# EAGLE design MPPC2 (EAGLE 8.2.2)
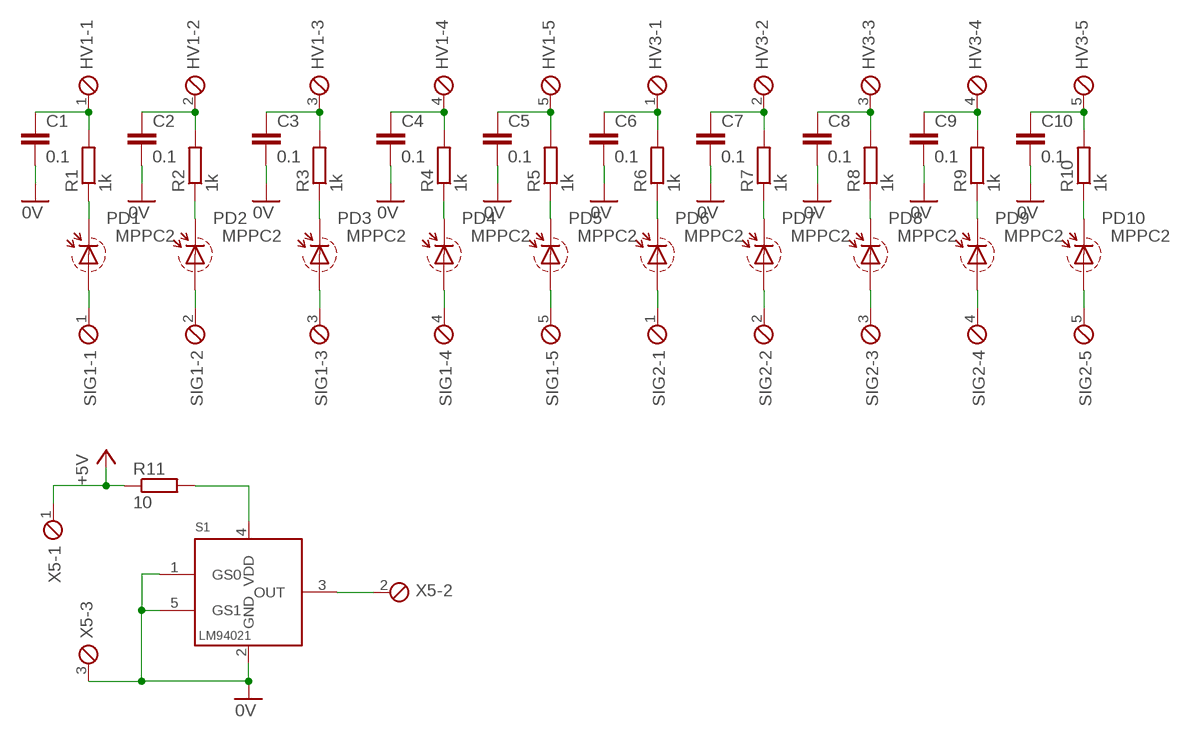
[diagram p0: schematic, sheet 1]

## Parts
C1  0.1  C-EUC0805K  [C0805K]
C2  0.1  C-EUC0805K  [C0805K]
C3  0.1  C-EUC0805K  [C0805K]
C4  0.1  C-EUC0805K  [C0805K]
C5  0.1  C-EUC0805K  [C0805K]
C6  0.1  C-EUC0805K  [C0805K]
C7  0.1  C-EUC0805K  [C0805K]
C8  0.1  C-EUC0805K  [C0805K]
C9  0.1  C-EUC0805K  [C0805K]
C10  0.1  C-EUC0805K  [C0805K]
HV1  MPT5  [5POL254]
HV3  MPT5  [5POL254]
PD1  MPPC2  [S13360-6050VE]
PD2  MPPC2  [S13360-6050VE]
PD3  MPPC2  [S13360-6050VE]
PD4  MPPC2  [S13360-6050VE]
PD5  MPPC2  [S13360-6050VE]
PD6  MPPC2  [S13360-6050VE]
PD7  MPPC2  [S13360-6050VE]
PD8  MPPC2  [S13360-6050VE]
PD9  MPPC2  [S13360-6050VE]
PD10  MPPC2  [S13360-6050VE]
R1  1k  R-EU_M0805  [M0805]
R2  1k  R-EU_M0805  [M0805]
R3  1k  R-EU_M0805  [M0805]
R4  1k  R-EU_M0805  [M0805]
R5  1k  R-EU_M0805  [M0805]
R6  1k  R-EU_M0805  [M0805]
R7  1k  R-EU_M0805  [M0805]
R8  1k  R-EU_M0805  [M0805]
R9  1k  R-EU_M0805  [M0805]
R10  1k  R-EU_M0805  [M0805]
R11  10  R-EU_R0805  [R0805]
S1  LM94021  [DCK_R-PDSO-G5]
SIG1  MPT5  [5POL254]
SIG2  MPT5  [5POL254]
X5  MPT3  [3POL254]

## Nets
0V: C1.2 C2.2 C3.2 C4.2 C5.2 C6.2 C7.2 C8.2 C9.2 C10.2 S1.1(GS0) S1.2(GND) S1.5(GS1) X5.3
+5V: R11.1 X5.1
N$1: PD2.C1(CATH) PD2.C2(CATH) PD2.C3(CATH) PD2.C4(CATH) R2.1
N$2: R11.2 S1.4(VDD)
N$3: S1.3(OUT) X5.2
N$4: C1.1 HV1.1 R1.2
N$5: PD1.C1(CATH) PD1.C2(CATH) PD1.C3(CATH) PD1.C4(CATH) R1.1
N$6: PD1.A1(ANODE) PD1.A2(ANODE) PD1.A3(ANODE) PD1.A4(ANODE) SIG1.1
N$7: PD2.A1(ANODE) PD2.A2(ANODE) PD2.A3(ANODE) PD2.A4(ANODE) SIG1.2
N$8: PD3.A1(ANODE) PD3.A2(ANODE) PD3.A3(ANODE) PD3.A4(ANODE) SIG1.3
N$9: PD4.A1(ANODE) PD4.A2(ANODE) PD4.A3(ANODE) PD4.A4(ANODE) SIG1.4
N$10: PD5.A1(ANODE) PD5.A2(ANODE) PD5.A3(ANODE) PD5.A4(ANODE) SIG1.5
N$11: PD6.A1(ANODE) PD6.A2(ANODE) PD6.A3(ANODE) PD6.A4(ANODE) SIG2.1
N$12: PD7.A1(ANODE) PD7.A2(ANODE) PD7.A3(ANODE) PD7.A4(ANODE) SIG2.2
N$13: PD8.A1(ANODE) PD8.A2(ANODE) PD8.A3(ANODE) PD8.A4(ANODE) SIG2.3
N$14: PD9.A1(ANODE) PD9.A2(ANODE) PD9.A3(ANODE) PD9.A4(ANODE) SIG2.4
N$15: PD10.A1(ANODE) PD10.A2(ANODE) PD10.A3(ANODE) PD10.A4(ANODE) SIG2.5
N$16: C2.1 HV1.2 R2.2
N$17: C3.1 HV1.3 R3.2
N$18: C4.1 HV1.4 R4.2
N$19: C5.1 HV1.5 R5.2
N$20: C6.1 HV3.1 R6.2
N$21: C7.1 HV3.2 R7.2
N$22: C8.1 HV3.3 R8.2
N$23: C9.1 HV3.4 R9.2
N$24: C10.1 HV3.5 R10.2
N$25: PD3.C1(CATH) PD3.C2(CATH) PD3.C3(CATH) PD3.C4(CATH) R3.1
N$26: PD4.C1(CATH) PD4.C2(CATH) PD4.C3(CATH) PD4.C4(CATH) R4.1
N$27: PD5.C1(CATH) PD5.C2(CATH) PD5.C3(CATH) PD5.C4(CATH) R5.1
N$28: PD6.C1(CATH) PD6.C2(CATH) PD6.C3(CATH) PD6.C4(CATH) R6.1
N$29: PD7.C1(CATH) PD7.C2(CATH) PD7.C3(CATH) PD7.C4(CATH) R7.1
N$30: PD8.C1(CATH) PD8.C2(CATH) PD8.C3(CATH) PD8.C4(CATH) R8.1
N$31: PD9.C1(CATH) PD9.C2(CATH) PD9.C3(CATH) PD9.C4(CATH) R9.1
N$32: PD10.C1(CATH) PD10.C2(CATH) PD10.C3(CATH) PD10.C4(CATH) R10.1

## Library data of the parts
C1-C10 = rcl:C-EU: CAPACITOR, European symbol
HV1 HV3 SIG1 SIG2 = con-phoenix-254:MPT5: PHOENIX CONNECTOR; OC_FARNELL: unknown; OC_NEWARK: unknown
PD1-PD10 = custom_parts:MPPC2: Hamamatsu S13360-6050VE tilable MPPC
R1-R11 = rcl:R-EU_: RESISTOR, European symbol
S1 = custom_parts:LM94021: TI Multi-gain analog temperature sensor
X5 = con-phoenix-254:MPT3: PHOENIX CONNECTOR; OC_FARNELL: unknown; OC_NEWARK: unknown

## Board
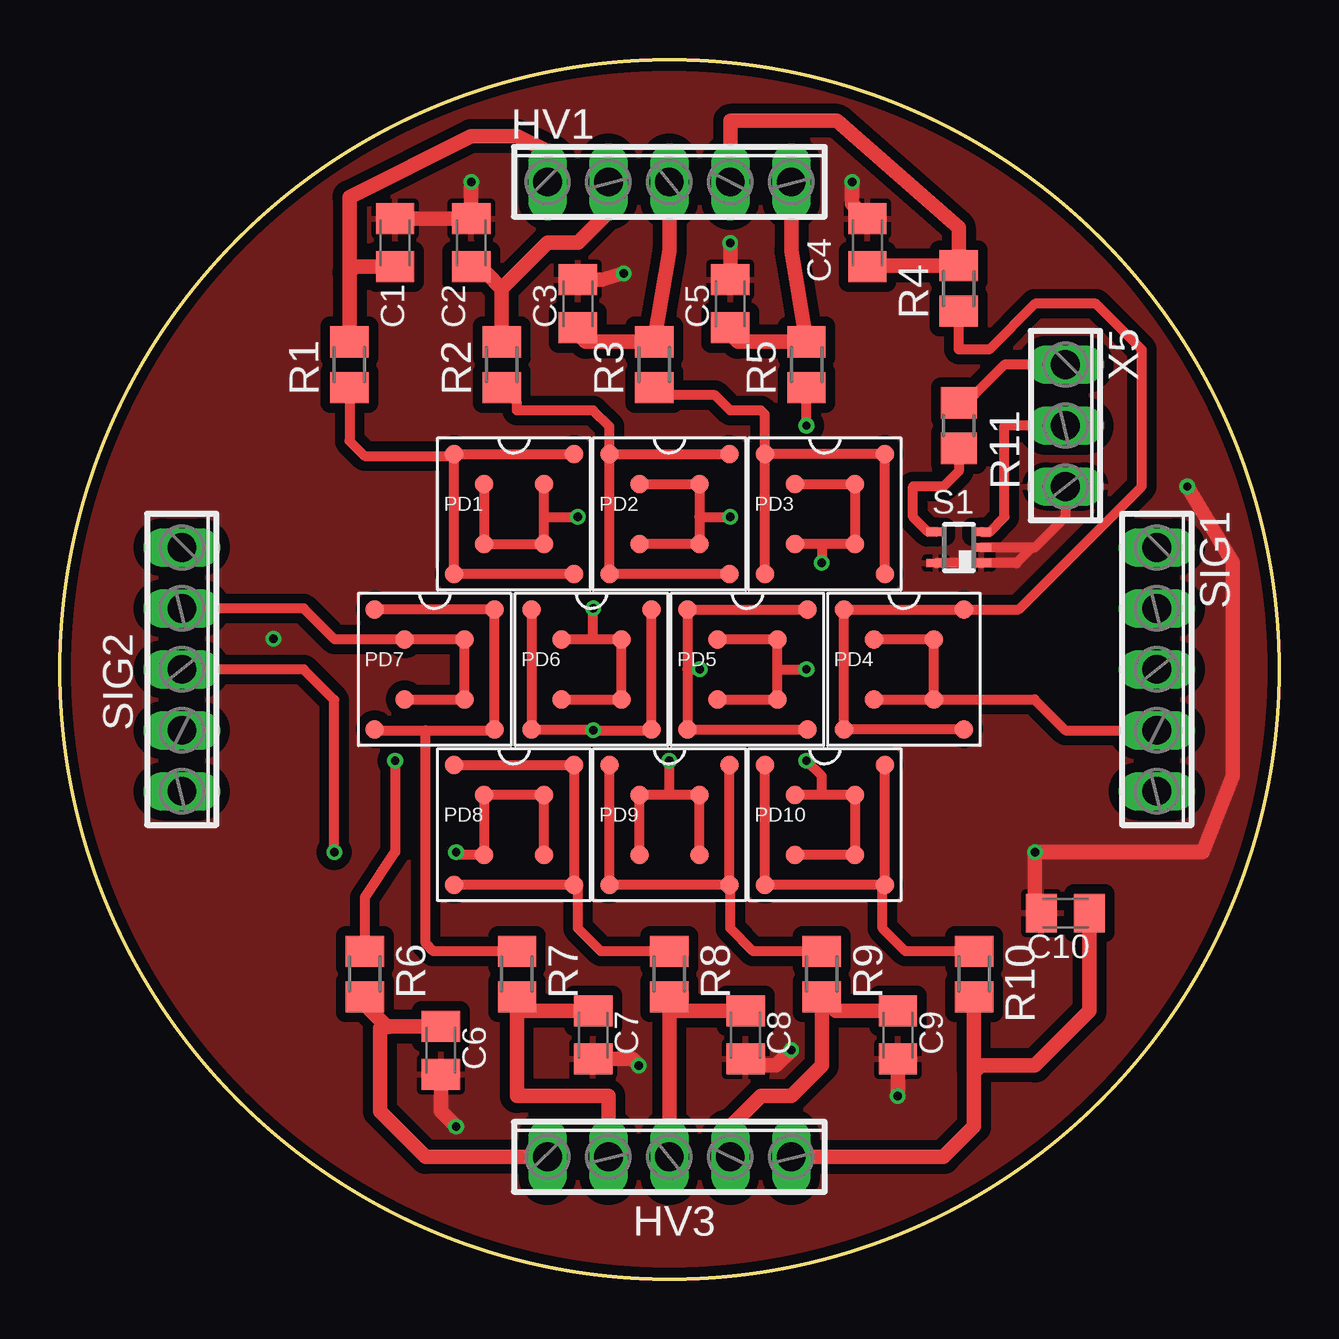
[diagram p1: board, top side]
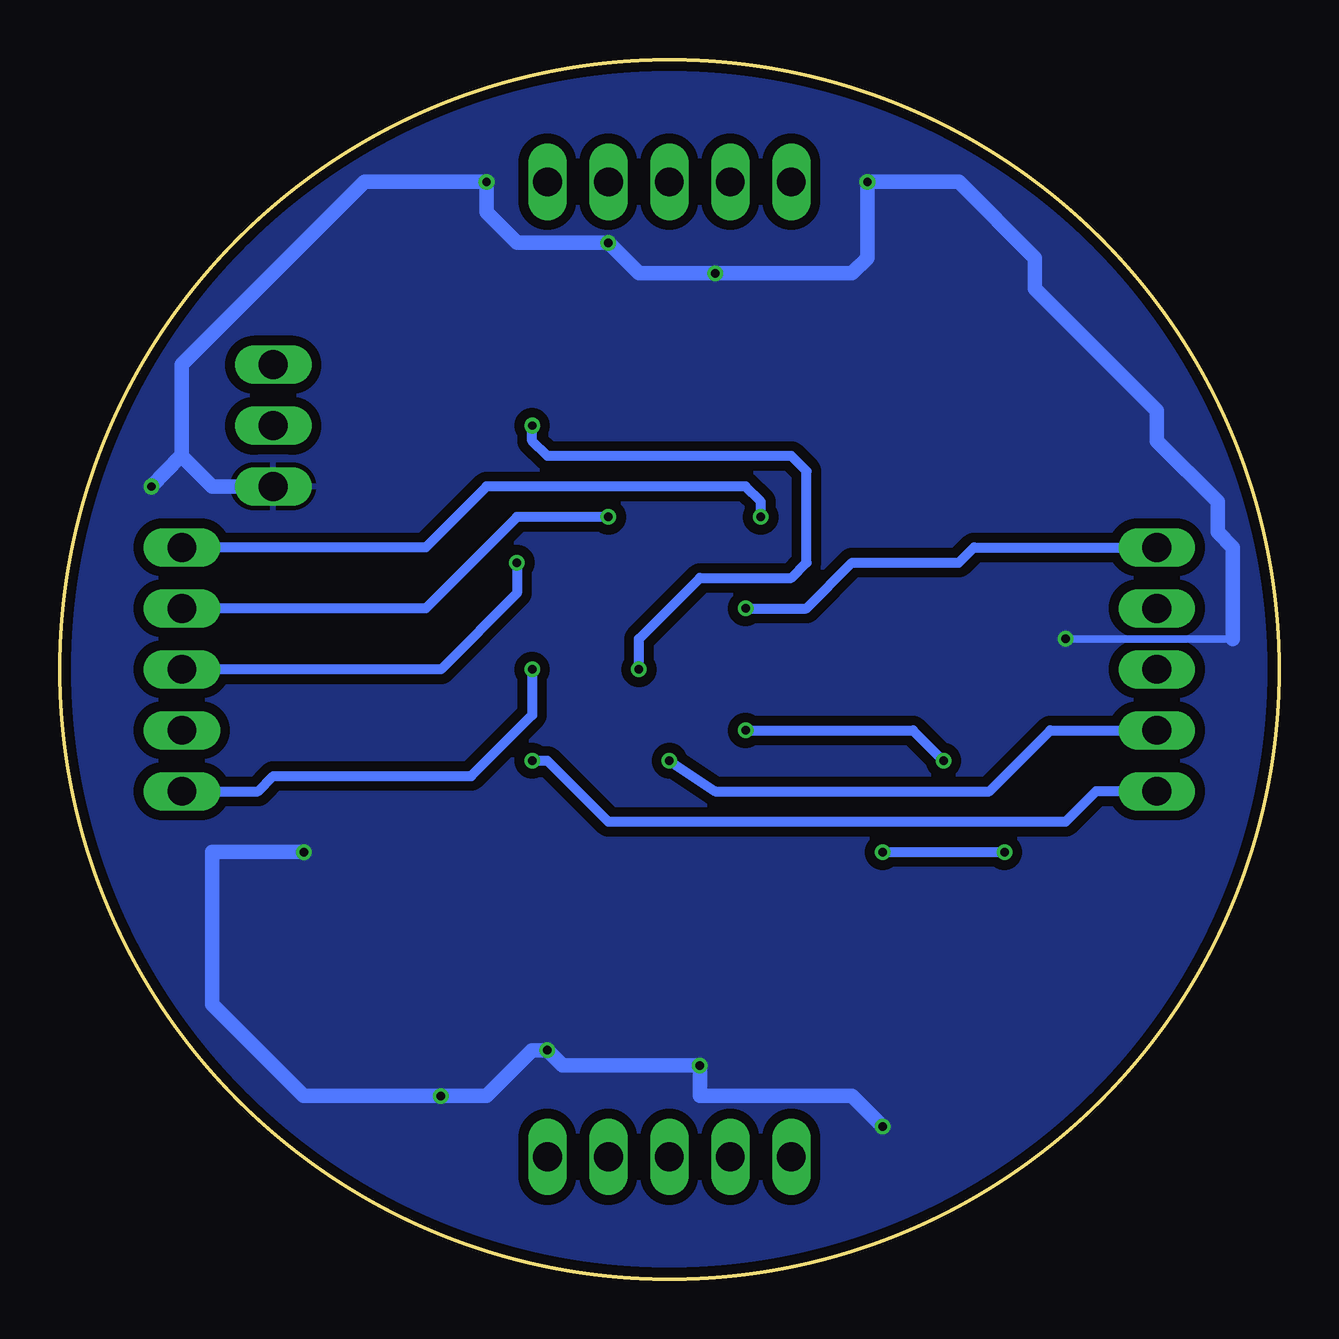
[diagram p2: board, bottom side, seen from below]

Size 50.8 x 50.8 mm. Coordinates in mm from the lower left corner, seen from the top.
Outline: circle at 25.4,25.4 radius 25.4
Copper layers (1*16): Top 0.035mm / dielectric 1.5mm / Bottom 0.035mm
Design rules "PCB-POOL Standard": minimum track width 0.15mm, minimum drill 0.3mm, track to track 0.15mm, track to pad 0.15mm, pad to pad 0.15mm, via to via 0.15mm, smd to smd 0.15mm, copper to edge 0.3mm, drill to drill 0.2mm, minimum pad ring 0.2mm, minimum via ring 0.15mm, stop-mask expansion 0.075mm, vias tented up to drill 0mil, thermal gap 0.2mm

### Footprints (pad centres in the part's own frame; a part is rotated, then mirrored left to right if it is on the bottom)
C0805K = smd 1.3 x 1.6: 1 -1,0; 2 1,0
5POL254 = drill 1.2 long: 1 -5.08,0; 2 -2.54,0; 3 0,0; 4 2.54,0; 5 5.08,0
S13360-6050VE = smd 0.762 x 0.762: A1 -1.25,1.25; A2 -1.25,-1.25; A3 1.25,-1.25; A4 1.25,1.25; C1 -2.5,2.5; C2 -2.5,-2.5; C3 2.5,-2.5; C4 2.5,2.5
M0805 = smd 1.3 x 1.6: 1 -0.95,0; 2 0.95,0
R0805 = smd 1.3 x 1.5: 1 -0.95,0; 2 0.95,0
DCK_R-PDSO-G5 = smd 0.35 x 0.8: 1 -0.65,-0.95; 2 0,-0.95; 3 0.65,-0.95; 4 0.65,0.95; 5 -0.65,0.95
3POL254 = drill 1.2 long: 1 -2.54,0; 2 0,0; 3 2.54,0

### Placement (x,y rotation side)
C1  13.97,43.18 90 top
C2  17.14,43.18 90 top
C3  21.59,40.64 90 top
C4  33.66,43.18 90 top
C5  27.94,40.64 90 top
C6  15.87,9.52 270 top
C7  22.22,10.16 270 top
C8  28.57,10.16 270 top
C9  34.92,10.16 270 top
C10  41.91,15.24 180 top
HV1  25.4,45.72 0 top
HV3  25.4,5.08 0 top
PD1  18.92,31.88 0 top
PD2  25.4,31.88 0 top
PD3  31.88,31.88 0 top
PD4  35.18,25.4 0 top
PD5  28.65,25.4 0 top
PD6  22.15,25.4 0 top
PD7  15.62,25.4 0 top
PD8  18.92,18.92 0 top
PD9  25.4,18.92 0 top
PD10  31.88,18.92 0 top
R1  12.06,38.1 90 top
R2  18.41,38.1 90 top
R3  24.76,38.1 90 top
R4  37.46,41.27 90 top
R5  31.11,38.1 90 top
R6  12.7,12.7 270 top
R7  19.05,12.7 270 top
R8  25.4,12.7 270 top
R9  31.75,12.7 270 top
R10  38.1,12.7 270 top
R11  37.46,35.56 270 top
S1  37.46,30.48 90 top
SIG1  45.72,25.4 270 top
SIG2  5.08,25.4 270 top
X5  41.91,35.56 270 top

### Tracks (layer width: path | path; a pad name or v marks a point on that pad's centre or on a via)
0V  (via drill 0.35)
  Top 0.406: X5.3 41.91,31.75 40.64,30.48 40.52,30.48 | 40.52,30.48 S1.2 | 40.52,30.48 39.87,29.83 S1.1 S1.5
  Top 0.61: C1.2 C2.2 v17.14,45.72 | C3.2 22.59,41.64 v23.49,41.91 | v27.94,43.18 C5.2 | v33.02,45.72 33.02,44.81 C4.2 | C6.2 15.87,6.98 v16.51,6.35 | C7.2 23.86,9.16 v24.13,8.89 | v34.92,7.62 C9.2 | v30.48,9.52 29.84,8.89 28.84,8.89 C8.2 | C10.2 40.64,15.51 v40.64,17.78 47.62,17.78 48.89,20.95 48.89,29.84 v46.99,33.02
  Bottom 0.305: 1.9,26.67 v8.89,26.67
  Bottom 0.61: 45.72,34.33 45.72,38.1 38.1,45.72 v33.02,45.72 33.02,44.45 31.75,43.18 v27.94,43.18 26.67,41.91 v23.49,41.91 17.78,41.91 17.14,42.55 v17.14,45.72 13.33,45.72 10.16,42.55 10.16,41.27 5.08,36.2 5.08,34.92 2.54,32.38 2.54,31.11 1.9,30.48 1.9,26.67 | 45.72,34.33 45.72,34.29 44.45,33.02 X5.3 | v16.51,6.35 17.78,7.62 24.13,7.62 v24.13,8.89 29.84,8.89 v30.48,9.52 31.11,9.52 33.02,7.62 v34.92,7.62 40.64,7.62 44.45,11.43 44.45,17.71 44.38,17.78 | 44.38,17.78 v40.64,17.78 | 44.38,17.78 44.45,17.78 | v46.99,33.02 45.76,34.29 45.72,34.33
  pour Top (isolate 0.406): 0,25.4 arc-90 25.4,50.8 arc-90 50.8,25.4 arc-90 25.4,0 arc-90
  pour Bottom (isolate 0.406): 0,25.4 arc-90 25.4,50.8 arc-90 50.8,25.4 arc-90 25.4,0 arc-90
+5V
  Top 0.406: X5.1 39.37,38.1 38.1,36.83 37.78,36.83 R11.1
N$1
  Top 0.406: PD2.C3 PD2.C2 PD2.C1 | PD2.C1 PD2.C4 | PD2.C1 22.9,35.52 22.22,36.2 19.05,36.2 19.05,36.52 R2.1
N$2
  Top 0.406: S1.4 36.18,31.13 35.56,31.75 35.56,33.02 36.83,33.02 37.46,33.66 R11.2
N$3
  Top 0.406: X5.2 39.37,35.56 39.37,31.75 38.75,31.13 S1.3
N$4
  Top 0.61: 12.06,41.95 R1.2 | 12.06,41.95 12.06,45.08 17.14,47.62 19.05,47.62 20.32,46.99 HV1.1 | C1.1 12.3,42.18 12.06,41.95
N$5
  Top 0.406: R1.1 12.06,34.92 12.7,34.29 16.34,34.29 PD1.C1 | PD1.C3 PD1.C2 PD1.C1 | PD1.C1 PD1.C4
N$6  (via drill 0.35)
  Top 0.406: PD1.A1 PD1.A2 PD1.A3 20.17,31.75 | 20.17,31.75 PD1.A4 | 20.17,31.75 v21.59,31.75
  Bottom 0.406: v21.59,31.75 21.59,32.38 22.22,33.02 33.02,33.02 35.56,30.48 SIG1.1
N$7  (via drill 0.35)
  Top 0.406: PD2.A1 PD2.A4 26.65,31.75 | 26.65,31.75 PD2.A3 PD2.A2 | 26.65,31.75 v27.94,31.75
  Bottom 0.406: v27.94,31.75 31.75,31.75 35.56,27.94 SIG1.2
N$8  (via drill 0.35)
  Top 0.406: PD3.A1 PD3.A4 PD3.A3 31.75,30.63 | 31.75,30.63 PD3.A2 | 31.75,30.63 v31.75,29.84
  Bottom 0.406: v31.75,29.84 31.75,28.57 34.92,25.4 SIG1.3
N$9
  Top 0.406: PD4.A2 PD4.A3 | PD4.A3 PD4.A4 PD4.A1 | PD4.A3 40.62,24.15 41.91,22.86 SIG1.4
N$10  (via drill 0.35)
  Top 0.406: PD5.A2 PD5.A3 29.9,25.4 | 29.9,25.4 PD5.A4 PD5.A1 | 29.9,25.4 v31.11,25.4
  Bottom 0.406: v31.11,25.4 31.11,23.49 33.66,20.95 41.91,20.95 42.55,20.32 SIG1.5
N$11  (via drill 0.35)
  Top 0.406: PD6.A2 PD6.A3 PD6.A4 22.22,26.65 | 22.22,26.65 PD6.A1 | 22.22,26.65 v22.22,27.94
  Bottom 0.406: SIG2.1 12.7,30.48 13.33,29.84 17.78,29.84 19.68,27.94 v22.22,27.94
N$12
  Top 0.406: PD7.A2 PD7.A3 PD7.A4 PD7.A1 11.45,26.65 10.16,27.94 SIG2.2
N$13  (via drill 0.35)
  Top 0.406: 20.09,20.17 PD8.A1 PD8.A2 16.62,17.67 v16.51,17.78 | 20.09,20.17 PD8.A4 | PD8.A3 20.17,20.09 20.09,20.17 | v11.43,17.78 11.43,24.13 10.16,25.4 SIG2.3
  Bottom 0.406: v16.51,17.78 v11.43,17.78
N$14  (via drill 0.35)
  Top 0.406: PD9.A2 PD9.A1 25.4,20.17 | 25.4,20.17 PD9.A4 PD9.A3 | 25.4,20.17 v25.4,21.59
  Bottom 0.406: v25.4,21.59 23.49,20.32 12.06,20.32 9.52,22.86 SIG2.4
N$15  (via drill 0.35)
  Top 0.406: 31.75,20.17 PD10.A4 PD10.A3 PD10.A2 | 31.75,20.17 PD10.A1 | 31.75,20.17 31.75,20.95 v31.11,21.59
  Bottom 0.406: SIG2.5 7.62,20.32 8.89,19.05 27.94,19.05 30.48,21.59 v31.11,21.59
N$16
  Top 0.61: 18.41,41.27 R2.2 | 18.41,41.27 17.78,41.91 17.41,41.91 C2.1 | HV1.2 22.86,44.45 21.59,43.18 20.32,43.18 18.41,41.27
N$17
  Top 0.61: HV1.3 25.4,42.86 R3.2 21.91,39.05 21.59,39.37 C3.1
N$18
  Top 0.61: HV1.4 27.94,48.26 32.38,48.26 37.46,43.81 R4.2 33.7,42.22 C4.1
N$19
  Top 0.61: HV1.5 30.48,42.86 R5.2 28.26,39.05 27.94,39.37 C5.1
N$20
  Top 0.61: 13.88,10.52 C6.1 | 13.88,10.52 13.6,10.52 12.7,11.43 R6.2 | HV3.1 15.24,5.08 13.33,6.98 13.33,10.44 13.88,10.52
N$21
  Top 0.61: C7.1 19.32,11.16 19.05,11.43 | 19.05,11.43 R7.2 | HV3.2 22.86,7.62 19.05,7.62 19.05,11.43
N$22
  Top 0.61: C8.1 25.67,11.16 25.4,11.43 | 25.4,11.43 R8.2 | HV3.3 25.4,11.43
N$23
  Top 0.61: C9.1 32.34,11.16 R9.2 31.75,8.89 30.48,7.62 29.21,7.62 27.94,6.35 HV3.4
N$24
  Top 0.61: HV3.5 36.83,5.08 38.1,6.35 38.1,8.59 | 38.1,8.59 R10.2 | C10.1 42.91,11.16 40.64,8.89 38.4,8.89 38.1,8.59
N$25
  Top 0.406: PD3.C2 PD3.C1 | PD3.C3 PD3.C4 PD3.C1 | PD3.C1 29.38,36.03 29.21,36.2 27.94,36.2 27.3,36.83 25.08,36.83 R3.1
N$26
  Top 0.406: 32.68,22.97 PD4.C1 PD4.C4 39.96,27.9 45.08,33.02 45.08,38.73 43.18,40.64 40.64,40.64 38.73,38.73 37.46,38.73 R4.1 | 32.68,22.97 PD4.C2 | PD4.C3 32.75,22.9 32.68,22.97
N$27  (via drill 0.35)
  Top 0.406: 26.28,27.9 PD5.C4 | 26.28,27.9 PD5.C1 | 26.15,25.4 26.15,27.77 26.28,27.9 | 26.15,25.4 PD5.C2 PD5.C3 | 26.15,25.4 v26.67,25.4 | v31.11,35.56 R5.1
  Bottom 0.406: v26.67,25.4 26.67,26.67 24.13,29.21 20.32,29.21 19.68,29.84 19.68,33.66 20.32,34.29 30.48,34.29 31.11,34.92 v31.11,35.56
N$28  (via drill 0.35)
  Top 0.406: PD6.C4 PD6.C3 24.61,22.86 v22.22,22.86 22.18,22.9 PD6.C2 PD6.C1 | v13.97,21.59 13.97,17.78 12.7,15.87 R6.1
  Bottom 0.406: v22.22,22.86 15.24,22.86 v13.97,21.59
N$29
  Top 0.406: R7.1 15.56,13.65 15.24,13.97 15.24,22.86 | 15.24,22.86 13.16,22.86 PD7.C2 | 15.24,22.86 18.08,22.86 PD7.C3 PD7.C4 PD7.C1
N$30
  Top 0.406: R8.1 22.54,13.65 21.59,14.6 21.59,16.26 PD8.C3 | PD8.C3 PD8.C2 | 21.42,21.37 PD8.C3 | 21.42,21.37 PD8.C4 | PD8.C1 21.37,21.42 21.42,21.37
N$31
  Top 0.406: R9.1 28.89,13.65 27.94,14.6 27.94,16.38 PD9.C3 | PD9.C3 PD9.C4 | PD9.C3 PD9.C2 PD9.C1
N$32
  Top 0.406: R10.1 35.24,13.65 34.29,14.6 34.29,16.34 PD10.C3 | PD10.C3 PD10.C2 PD10.C1 | PD10.C3 PD10.C4

### Text on the board
tValues: 5 | 1 | 6 | 1 | 5 | 10 | 6 | 10